# Altium schematic sheet Power.SchDoc
size A4; SheetNumber: 2; SheetTotal: 2
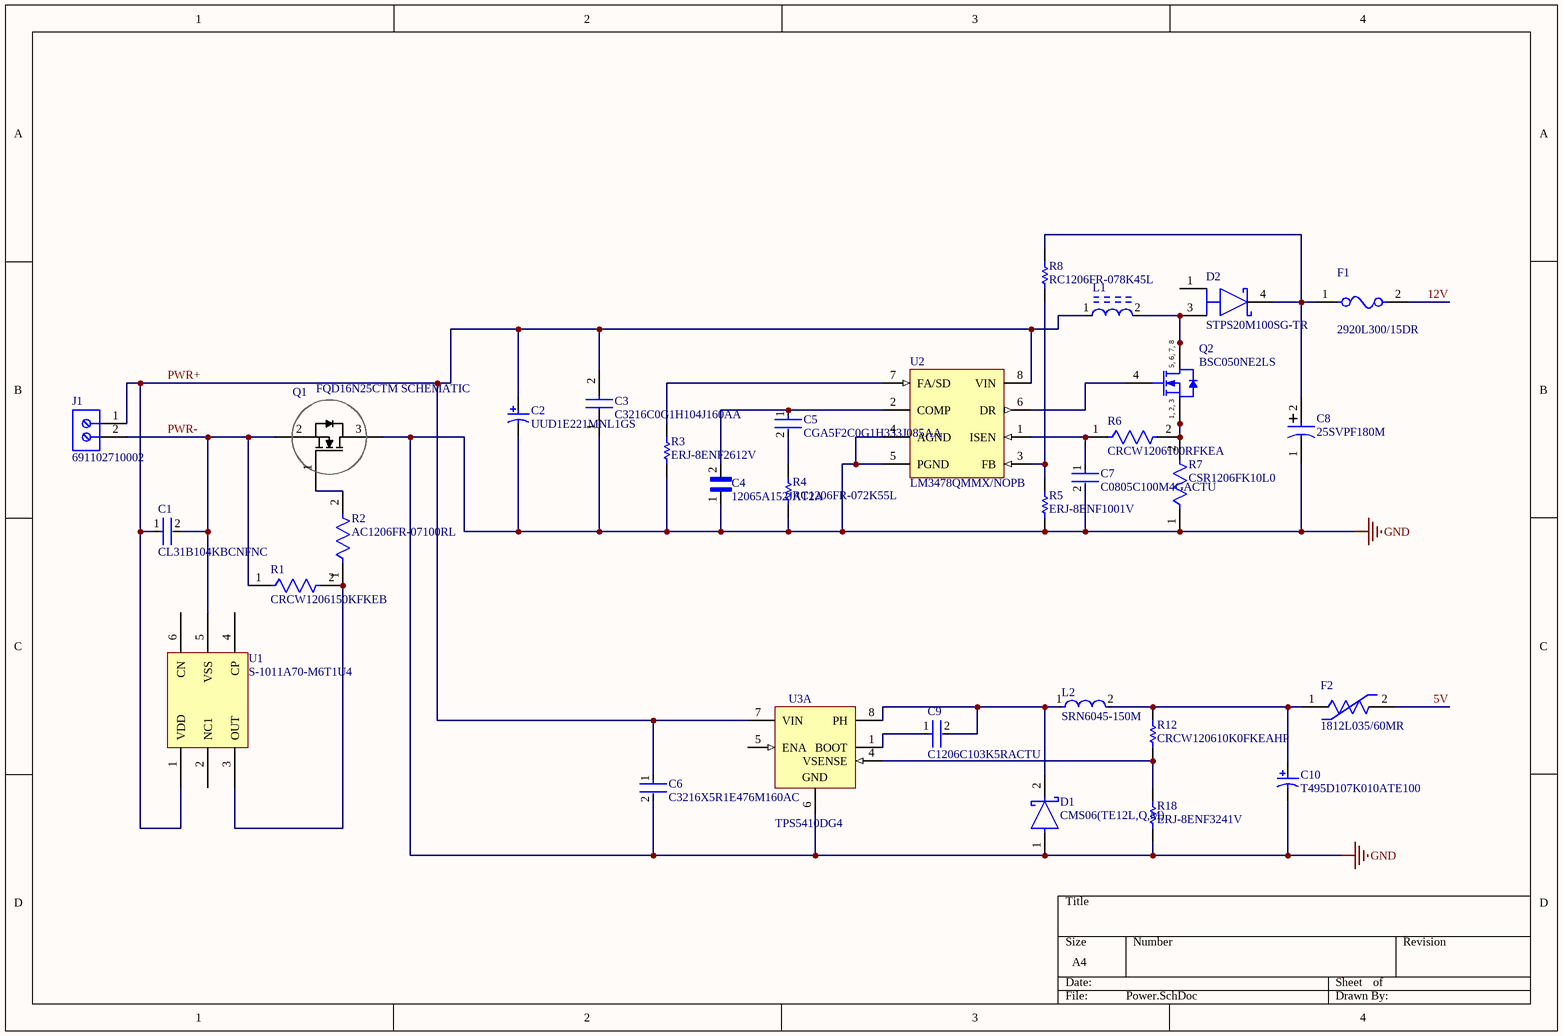
[diagram p0: Power.SchDoc]

## Parts
C1  CL31B104KBCNFNC  [FP-CL31-IPC_C]
C2  UUD1E221MNL1GS  [NIC-CAPA2-8X10_V]
C3  C3216C0G1H104J160AA  [C3216_Commercial]
C4  12065A152JAT2A  [CAPC3216X94N]
C5  CGA5F2C0G1H333J085AA  [FP-CGA5L-0_3-0_1-IPC_C]
C6  C3216X5R1E476M160AC  [FP-C3216-160-MFG]
C7  C0805C100M4GACTU  [FP-C0805C-DN-MFG]
C8  25SVPF180M  [FCV(8X10.2)]
C9  C1206C103K5RACTU  [FP-C1206C-EB-MFG]
C10  T495D107K010ATE100  [KEMT-T495-D_L]
D1  CMS06(TE12L,Q,M)  [FP-M-FLAT-MFG]
D2  STPS20M100SG-TR  [FP-STPS20M100SG-TR-MFG]
F1  2920L300/15DR  [FP-2920L-MFG]
F2  1812L035/60MR  [FP-1812L035-60MR-MFG]
J1  691102710002  [691102710002]
L1  SRP1250-4R7M  [FP-SRP1250-MFG]  (value not drawn)
L2  SRN6045-150M  [FP-SRN6045-MFG]
Q1  FQD16N25CTM SCHEMATIC  [FQD16N25CTM]
Q2  BSC050NE2LS  [INF-PG-TDSON-8-1_V]
R1  CRCW1206150KFKEB  [FP-CRCW1206-e3-IPC_B]
R2  AC1206FR-07100RL  [FP-AC1206-MFG]
R3  ERJ-8ENF2612V  [RESC3216X70X50LL05T20]
R4  RC1206FR-072K55L  [RESC3116X65X40ML10T20]
R5  ERJ-8ENF1001V  [RESC3216X70X50LL05T20]
R6  CRCW1206100RFKEA  [FP-CRCW1206-e3-MFG]
R7  CSR1206FK10L0  [FP-CSR1206-MFG]
R8  RC1206FR-078K45L  [RESC3116X65X40NL10T20]
R12  CRCW120610K0FKEAHP  [RESC3116X65X50NL20T20]
R18  ERJ-8ENF3241V  [RESC3216X70X50LL05T20]
U1  S-1011A70-M6T1U4  [S-1011A70-M6T1U4]
U2  LM3478QMMX/NOPB  [DGK0008A_N]
U3  TPS5410DG4  [D8_L]  (part A of 2)

## Nets
GND: C2.2 C3.1 C4.1 C6.2 C7.2 C8.1(+) C10.2 D1.1(A) Q1.3 R3.1 R4.1 R5.1 R7.1 R18.1 U2.4(AGND) U2.5(PGND) U3.6(GND)
5V: F2.2
12V: F1.2
PWR+: C1.1 C2.1 C3.2 C6.1 J1.1 L1.1 U1.1(VDD) U2.8(VIN) U3.7(VIN)
PWR-: C1.2 J1.2 Q1.2 R1.1 U1.5(VSS)
NetC4_2: C4.2 C5.1 U2.2(COMP)
NetC5_2: C5.2 R4.2
NetC7_1: C7.1 R6.1 U2.1(ISEN)
NetC8_2: C8.2(-) D2.4(K) F1.1 R8.2
NetC9_1: C9.1 U3.1(BOOT)
NetC9_2: C9.2 D1.2(C) L2.1 U3.8(PH)
NetC10_1: C10.1 F2.1 L2.2 R12.2
NetD2_3: D2.3(A) L1.2 Q2.5(DRAIN) Q2.6(DRAIN) Q2.7(DRAIN) Q2.8(DRAIN)
NetQ1_1: Q1.1 R2.2
NetQ2_1: Q2.1(SOURCE) Q2.2(SOURCE) Q2.3(SOURCE) R6.2 R7.2
NetQ2_4: Q2.4(GATE) U2.6(DR)
NetR1_2: R1.2 R2.1 U1.3(OUT)
NetR3_2: R3.2 U2.7(FA/SD)
NetR5_2: R5.2 R8.1 U2.3(FB)
NetR12_1: R12.1 R18.2 U3.4(VSENSE)

Not connected (* = marked no-connect by the designer): D2 1(A); U1 2(NC1) 4(CP) 6(CN); U3 5(ENA)

## Notes on the sheet
- (in symbol CMP-1090-00044-1) 5, 6, 7, 8; 1, 2, 3

## Library data of the parts
C1 = CMP-13271-001276-1: Cap Ceramic 100nF 50V X7R ±10% SMD 1206 +125°C Embossed T/R; Dielectric: X7R; Case Code (Metric): 3216; Package Quantity: 1; Thickness: 0.037inch; Depth: 1.6mm; Packaging: Tape and Reel; Capacitance: 100nF; Length: 0.126inch; Tolerance: 10%; Voltage Rating: 50V; Case Code (Imperial): 1206; Radiation Hardening: No; Width: 0.063inch; Case/Package: 1206; Max Operating Temperature: 125°C; Min Operating Temperature: -55°C; Height: 0.85mm; Mount: Surface Mount
C2 = CMP-0687-00079-1: Aluminum Electrolytic Capacitor, UD Series, Low Impedance, 220 uF, 25 V, + / - 20%, -55 to 105 degC, Chip Type, 8 x 10 mm D x L, Pb-Free, Reel; Manufacturer: Nichicon; Impedance: 0.17 Ohm; Tolerance Rated Capacitance: -20 to 20%; Packing: Dia382mm Reel; Endurance Time: 5000 h; Rated Voltage: 25 V; Rated Ripple Current (at 100kHz): 450 mA; Rated Capacitance: 220 uF; PartNumber: UUD1E221MNL1GS; DatasheetVersion: 08/2012; ComponentLink1Description: Manufacturer URL; Length: 10 mm; ComponentLink3Description: Package Specification; RoHS: TRUE; ComponentLink2Description: Datasheet; Diameter: 8 mm; ComponentLink2URL: http://products.nichicon.co.jp/en/pdf/XJA043/e-ud.pdf; ComponentLink3URL: http://products.nichicon.co.jp/en/pdf/XJA043/e-ud.pdf; PackageReference: CAPAE-D8H10; ComponentLink1URL: http://www.nichicon.co.jp/; PackageDescription: 2-Pin Surface Mount Device, Diameter 8 mm, Height 10 mm, Pitch 6.5 mm; Mounting Technology: Surface Mount
C3 = C3216C0G1H104J160AA: Capacitor; Manufacturer_Name: TDK; Datasheet Link: https://product.tdk.com/system/files/dam/doc/product/capacitor/ceramic/mlcc/catalog/mlcc_commercial_general_en.pdf; Height: 0.75mm; Manufacturer_Part_Number: C3216C0G1H104J160AA
C4 = 12065A152JAT2A: 1500PF 50V 5% 1206; Package: None; Price: None; Value: *; MP: 12065A152JAT2A; Availability: Unavailable
C5 = CMP-08246-000336-1: Cap Ceramic 33nF 50V C0G 5% Pad SMD 1206 +125°C Automotive T/R; Thickness: 0.037inch; Case/Package: 1206; Min Operating Temperature: -55°C; Max Operating Temperature: 125°C; Case Code (Metric): 3216; Voltage Rating: 50V; Width: 0.063inch; Packaging: Tape and Reel; Ratings: AEC-Q200; Height: 0.85mm; Mount: Surface Mount; Weight: 0.000571oz; Tolerance: 5%; Dielectric: C0G; Package Quantity: 1; Depth: 1.6mm; Voltage Rating (DC): 50V; Termination: SMD/SMT; Case Code (Imperial): 1206; Composition: Ceramic; Capacitance: 33nF; Length: 3.2mm
C6 = CMP-2000-05397-2: CAP CER 47UF 25V X5R 1206; 3DS Part Number: 220-00004; Manufacturer: TDK; Temperature Coefficient: 15%; Tolerance: 20%; Material: Ceramic; Height: 1.8mm; Device Class L1: Passive Components; Temperature Characteristic: X5R; Voltage: 25V; Digikey Description: CAP CER 47UF 25V X5R 1206; Voltage Rating: 25V; ComponentLink2URL: https://product.tdk.com/info/en/catalog/datasheets/mlcc_commercial_general_en.pdf; Category: Cap; Capacitance: 47uF; Ipc Land Pattern Name: CAPC320160X160; Temperature Range High: +85°C; ComponentLink2Description: Datasheet; Temperature: -55°C to +85°C; Mouser Description: Multilayer Ceramic Capacitors MLCC - SMD/SMT 1206 47uF 25volts X5R 20%; Lead Free: Yes; RoHS: TRUE; Device Class L2: Capacitors; Device Class L3: Ceramic Capacitors; Manufacturer Part Number: C3216X5R1E476M160AC; Automotive: No; Temperature Range Low: -55°C; Footprint Url: https://product.tdk.com/info/en/catalog/spec/mlccspec_commercial_general_midvoltage_en.pdf; Value: 47uF; Octopart: https://octopart.com/c3216x5r1e476m160ac-tdk-25947783; Package: C3216-160
C7 = CMP-1036-00838-4: CAP CER 10PF 16V 20% NP0 0805; Manufacturer: KEMET; Material: Ceramic; Tolerance: 0.2; Temperature Characteristic: C0G; Temperature Coefficient: 30ppm/°C; Height: 0.88mm; Mouser Description: Multilayer Ceramic Capacitors MLCC - SMD/SMT 16volts 10pF C0G 20%; Device Class L2: Capacitors; Temperature Range Low: -55°C; Manufacturer Part Number: C0805C100M4GACTU; ComponentLink2URL: https://content.kemet.com/datasheets/KEM_C1003_C0G_SMD.pdf; Category: Cap; Octopart: https://octopart.com/c0805c100m4gactu-kemet-16430157; Device Class L1: Passive Components; Capacitance: 10 pF; Temperature: -55°C to +125°C; RoHS: TRUE; Package: C0805C-DN; Device Class L3: Ceramic Capacitors; Automotive: No; Value: 10 pF; Voltage Rating: 16 V; Digikey Description: CAP CER 10PF 16V 20% NP0 0805; Temperature Range High: +125°C; Ipc Land Pattern Name: CAPC200125X78; Lead Free: Yes; ComponentLink2Description: Datasheet
C8 = 25SVPF180M: Capacitor; Manufacturer_Name: Panasonic; Datasheet Link: https://componentsearchengine.com//25SVPF180M.pdf; Mouser2 Part Number: 667-25SVPF180M; Mouser2 Price/Stock: https://www.mouser.com/Search/Refine.aspx?Keyword=667-25SVPF180M; Manufacturer_Part_Number: 25SVPF180M
C9 = CMP-2000-06008-2: CAP CER 10000PF 50V X7R 1206; Manufacturer: KEMET; Material: Ceramic; Temperature Coefficient: 15%; Capacitance: 10,000 pF; Automotive Grade: Grade 0; Value: 10,000 pF; Tolerance: 0.1; Height: 0.88mm; Digikey Description: CAP CER 10000PF 50V X7R 1206; Temperature Range Low: -55°C; Temperature: -55°C to +150°C; Temperature Range High: +150°C; Automotive: Yes; RoHS: TRUE; Lead Free: Yes; Device Class L3: Ceramic Capacitors; Device Class L2: Capacitors; Device Class L1: Passive Components; Octopart: https://octopart.com/c1206c103k5ractu-kemet-130245; Category: Cap; ComponentLink2Description: Datasheet; Mouser Description: Multilayer Ceramic Capacitors MLCC - SMD/SMT 50volts 10000pF X7R 10%; ComponentLink2URL: https://content.kemet.com/datasheets/KEM_C1007_X8R_ULTRA_150C_SMD.pdf; Voltage Rating: 50 V; Package: C1206C-EB; Manufacturer Part Number: C1206C103K5RACTU; Temperature Characteristic: X7R; Ipc Land Pattern Name: CAPC320160X78
C10 = CMP-2000-07206-1: Capacitor, Tantalum, 100 uF, +/- 10%, 10 V, -55 to 125 degC, 2-Pin SMD, RoHS, Tape and Reel; Manufacturer: Kemet; Brand/Series: T495Series; Manufacturer URL: http://www.kemet.com/; Package Description: 2-Pin Surface Mount Device, Body 7.3 x 4.3 mm; Mounting Technology: SurfaceMount; Package Reference: T495-D; Packaging: Tape&amp;Reel; Termination: SMD; Mounting Type: PCB; Material, Element: Tantalum; Datasheet Version: 09/2016; Datasheet URL: http://capacitoredge.kemet.com/capedge2/DataSheet/Datasheet-T495D107K010ATE100.pdf?pn=T495D107K010ATE100
D1 = CMP-2000-06115-2: DIODE SCHOTTKY 30V 2A MFLAT; Forward Voltage: 370mV; Peak Non-Repetitive Surge Current: 40A; Max Reverse Leakage Current: 3mA; Element Configuration: Single; Package Quantity: 1; Max Operating Temperature: 125°C; Mount: Surface Mount; Max Repetitive Reverse Voltage (Vrrm): 30V; Forward Current: 2A; Number of Pins: 2; Min Operating Temperature: -40°C; Radiation Hardening: No; Average Rectified Current: 2A; Contact Plating: Tin; Max Reverse Voltage (DC): 30V; Peak Reverse Current: 3mA; Max Surge Current: 40A; Packaging: Tape and Reel
D2 = CMP-12187-000010-1: DIODE SCHOTTKY 100V 20A D2PAK; Manufacturer: STMicroelectronics; Peak Reverse Current: 10uA; Max Junction Temp: +150°C; Standoff Height: 0mm; Max Surge Forward Current: 350A; Forward Current: 20A; Temperature: to +150°C; Device Class L3: Schottky Diodes; Temperature Range High: +150°C; Device Class L1: Discrete Semiconductors; Mouser Description: Schottky Diodes & Rectifiers 20A 100V; Category: Diode; Max Repetitive Reverse Voltage: 100V; ComponentLink2Description: Datasheet; RoHS: TRUE; ComponentLink2URL: https://www.st.com/resource/en/datasheet/stps20m100s.pdf; Octopart: https://octopart.com/stps20m100sg-tr-stmicroelectronics-17669033; Lead Free: Yes; Package: STPS20M100SG-TR; Height: 4.85mm; Device Class L2: Diodes; Automotive: No; Digikey Description: DIODE SCHOTTKY 100V 20A D2PAK; Manufacturer Part Number: STPS20M100SG-TR
F1 = CMP-2000-05550-2: PTC RESET FUSE 15V 3A 2920; Manufacturer: Littelfuse; Current Rating: 40A; Trip Current: 5A; Trip Time: 20s; Resistance: 0.015-0.048Ω; Value: 0.015-0.048Ω; Device Class L3: unset; Temperature: -40°C to +85°C; ComponentLink2Description: Datasheet; Temperature Range High: +85°C; Digikey Description: PTC RESET FUSE 15V 3A 2920; Lead Free: Yes; Height: 1.25mm; Voltage Rating: 15V; Package: 2920L; Temperature Range Low: -40°C; Ambient Temperature Range High: +85°C; RoHS: TRUE; Ambient Temperature Range Low: -40°C; Device Class L2: PTC Resettable Fuses; Category: Fuse; Automotive: No; ComponentLink2URL: https://m.littelfuse.com/~/media/electronics/datasheets/resettable_ptcs/littelfuse_ptc_2920l_datasheet.pdf.pdf; Device Class L1: Circuit Protection; Hold Current: 3A; Manufacturer Part Number: 2920L300/15DR; Octopart: https://octopart.com/2920l300%2F15dr-littelfuse-673797
F2 = CMP-08606-000011-1: PTC RESET FUSE 60V 350MA 1812; Manufacturer: Littelfuse; Hold Current: 0.35A; Trip Time: 0.15s; Current Rating: 10A; Value: 0.4-1.7Ω; Trip Current: 0.7A; Lead Free: Yes; Voltage Rating: 60V; ComponentLink2URL: https://www.littelfuse.com/~/media/electronics/datasheets/resettable_ptcs/littelfuse_ptc_1812l_datasheet.pdf.pdf; Octopart: https://octopart.com/1812l035%2F60mr-littelfuse-75250819; Automotive: No; Temperature Range Low: -40°C; RoHS: TRUE; Ambient Temperature Range High: +85°C; ComponentLink2Description: Datasheet; Manufacturer Part Number: 1812L035/60MR; Device Class L3: unset; Device Class L2: PTC Resettable Fuses; Ambient Temperature Range Low: -40°C; Temperature: -40°C to +85°C; Package: 0; Temperature Range High: +85°C; Height: 1.8mm; Category: Fuse; Digikey Description: PTC RESET FUSE 60V 350MA 1812; Device Class L1: Circuit Protection; Resistance: 0.4-1.7Ω
J1 = CMP-1502-03258-1: Series 102 - 5.00 mm Horizontal Entry Modular with Pressure Clamp WR-TBL, 2 pin; Manufacturer: Wurth Elektronik; Pin Number: 2; Pitch: 5.00mm; Manufacturer URL: http://www.we-online.de; Mounting Technology: THT; Publisher: WurthElektronik; Packaging: Box; Package Reference: 691102710002; Datasheet URL: http://katalog.we-online.de/em/datasheet/6911027100xx.pdf; Operating Temperature: -40to105degC; Part Number: 691102710002
L1 = CMP-07248-000044-1: FIXED IND 4.7UH 12A 15 MOHM SMD; Material: Ferrite; Tolerance: 20%; Shielding: Shielded; Saturation Current: 27A; Test Frequency: 100kHz; DC Resistance (DCR): 15mR; Radiation Hardening: No; DC Current: 12A; Composition: Wirewound; Military Standard: Not; Inductance: 4.7uH; Case/Package: Nonstandard; Max Operating Temperature: 150°C; Number of Pins: 2; Inductance Tolerance: 20%; Core Material: Ferrite; Current Rating: 12A; Min Operating Temperature: -55°C; RMS Current (Irms): 12A; Termination: SMD/SMT; Mount: Surface Mount; Max DC Current: 12A; Height - Seated (Max): 0.205inch; Package Quantity: 500; Depth: 13.5mm; Width: 13.5mm; Length: 13.9mm; Packaging: Tape and Reel; Height: 5.2mm; REACH SVHC: No SVHC
L2 = CMP-07248-000050-1: FIXED IND 15UH 1.9A 95.8MOHM SMD; Inductance Tolerance: 20%; Self Resonant Frequency: 13MHz; Saturation Current: 2.3A; Core Material: Ferrite; Shielding: Shielded; DC Resistance (DCR): 95.8mR; Test Frequency: 100kHz; Termination: SMD/SMT; Depth: 6.2mm; Max DC Current: 1.9A; Height: 4.5mm; Max Operating Temperature: 125°C; Package Quantity: 1000; Resistor Type: Wirewound; Min Operating Temperature: -40°C; Width: 6mm; Inductance: 15uH; Weight: 0.027725oz; Mount: Surface Mount; Length: 6mm; Series: SRN6045; Packaging: Tape and Reel; DC Current: 1.9A; Number of Pins: 2; Military Standard: Not; REACH SVHC: No SVHC; Tolerance: 20%; Height - Seated (Max): 0.177inch; Current Rating: 1.9A; Case/Package: Nonstandard; RMS Current (Irms): 1.9A
Q2 = CMP-1090-00044-1: N-Channel OptiMOS Power-MOSFET, 25 V VDS, 58 A ID, -55 to 150 degC, PG-TDSON-8-1, Reel, Green; Manufacturer: Infineon; RthJA (max): 50Â K/W; Polarity: N; RthJC (max): 4.5Â K/W; RDS (on) (max): 5Â mOhm; Ptot (max): 28Â W; RDS (on) (max) (@4.5V): 7.1Â mOhm; ID (max): 58Â A; VGS(th) (min): 1.2Â V; VDS (max): 25Â V; QG: 5Â nC; Green: TRUE; IDpuls (max): 232Â A; VGS(th) (max): 2Â V; ComponentLink3Description: Package Specification; ComponentLink2URL: http://www.infineon.com/dgdl/BSC050NE2LS_Rev+2.1_.pdf?folderId=db3a304326dfb1300126fb3bec803f1a&fileId=db3a304326dfb1300126fb5ce0cb3f2d; ComponentLink1Description: Manufacturer URL; Rth: 4.5Â K/W; ComponentLink3URL: http://www.infineon.com/cms/packages/SMD_-_Surface_Mounted_Devices/P-PG-TDSON/P-PG-TDSON-08-01x_2x_3.html?__locale=en; PackageReference: PG-TDSON-8-1; PartNumber: BSC050NE2LS; PackageDescription: 8-Pin Plastic (Green) Thin Dual Small Outline Non-Leaded Package, 5.15 x 5.9 mm Body, 1.27 mm Pitch; DatasheetVersion: Rev. 2.1; Packing: Reel; Mounting Technology: Surface Mount; ComponentLink1URL: http://www.infineon.com/; ComponentLink2Description: Datasheet; Halogen-free: TRUE
R1 = CMP-02407-004217-1: RES Thick Film, 150kΩ, 1%, 0.25W, 100ppm/°C, 1206; Voltage Rating: 200V; Resistance: 150kR; Max Power Dissipation: 250mW; Composition: Thick Film; Tolerance: 1%; Case Code (Imperial): 1206; Temperature Coefficient: 100ppm/°C; Min Operating Temperature: -55°C; Package Quantity: 10000; Military Standard: Not; Length: 3.2mm; Width: 0.063inch; Case Code (Metric): 3216; Features: Automotive AEC-Q200; Lead Free: Lead Free; Height: 0.024inch; Packaging: Tape and Reel; Weight: 0.000353oz; Depth: 1.6mm; Number of Terminations: 2; Case/Package: 1206; Max Operating Temperature: 155°C; Power Rating: 250mW
R2 = CMP-03412-017343-1: RES SMD 100 OHM 1% 1/4W 1206; Manufacturer: Yageo; Voltage Rating: 200V; Automotive Grade: Grade 0; Resistance: 100Ω; Value: 100Ω; Tolerance: 0.01; Power Rating: 0.25W; Octopart: https://octopart.com/ac1206fr-07100rl-yageo-30511025; Device Class L2: Resistors; RoHS: TRUE; Composition: Thick Film; Device Class L3: Chip SMD Resistors; Temperature: -55°C to +155°C; Temperature Range High: +155°C; ComponentLink2URL: http://www.yageo.com/NewPortal/yageodocoutput?fileName=/pdf/R-Chip/PYu-AC_51_RoHS_L_6.pdf; Manufacturer Part Number: AC1206FR-07100RL; Digikey Description: RES SMD 100 OHM 1% 1/4W 1206; Temperature Range Low: -55°C; ComponentLink2Description: Datasheet; Automotive: Yes; Height: 0.65mm; Mouser Description: Thick Film Resistors - SMD 1/4W 100ohm 1% AEC-Q200; Series: AC; Footprint Url: http://www.yageo.com/exep/pages/download/literatures/PYu-R_Mount_10.pdf; Category: Res; Package: AC1206; Device Class L1: Passive Components; Lead Free: Yes; Ipc Land Pattern Name: RESC310160X55
R3 = CMP-2003-00257-1: Manufacturer: Panasonic; Part Number: ERJ-8ENF2612V
R4 = CMP-2003-03669-1: Manufacturer: Yageo; Part Number: RC1206FR-072K55L
R5 = CMP-2003-00017-1: Manufacturer: Panasonic; Part Number: ERJ-8ENF1001V
R6 = CMP-2003-04801-2: RES Thick Film, 100Ω, 1%, 0.25W, 100ppm/°C, 1206; Voltage Rating (DC): 200V; Resistance: 100R; Power Rating: 250mW; Case Code (Metric): 3216; Radiation Hardening: No; Height: 0.55mm; Packaging: Tape and Reel; Depth: 1.6mm; Weight: 0.000353oz; Termination: SMD/SMT; Lead Free: Lead Free; Min Operating Temperature: -55°C; Contact Plating: Tin; Max Operating Temperature: 155°C; Case Code (Imperial): 1206; Military Standard: Not; Width: 1.6mm; Number of Pins: 2; Voltage Rating: 200V; Composition: Thick Film; Package Quantity: 5000; Tolerance: 1%; Case/Package: 1206; Mount: Surface Mount; Length: 3.2mm; Temperature Coefficient: 100ppm/°C
R7 = CMP-26527-000118-1: RES 0.01 OHM 1% 1/2W 1206; Max Power Dissipation: 500mW; Temperature Coefficient: 100ppm/°C; Resistance: 10mR; RoHS Compliant: Yes; Construction: Rectangular; Resistor Type: Thick Film; Military Standard: Not; Lead Free: Lead Free; Size Code: 1206; Case/Package: 1206; Case Code (Metric): 3216; Radiation Hardening: No; Contact Plating: Tin; Series: CSR; Max Operating Temperature: 155°C; Power Rating: 500mW; Mount: Surface Mount; Number of Terminations: 2; Packaging: Tape and Reel; Length: 0.12inch; Min Operating Temperature: -55°C; Width: 0.061inch; Depth: 1.55mm; Case Code (Imperial): 1206; Height: 0.026inch; Tolerance: 1%
R8 = CMP-2003-03894-1: Manufacturer: Yageo; Part Number: RC1206FR-078K45L
R12 = CMP-2003-04883-1: Manufacturer: Vishay Dale; Part Number: CRCW120610K0FKEAHP
R18 = CMP-2003-00303-1: Manufacturer: Panasonic; Part Number: ERJ-8ENF3241V
U2 = CMP-0063-01299-4: High Efficiency Low-Side N-Channel Controller for Switching Regulator, Automotive Grade 1, 8-pin MSOP, Pb-Free, 3500 Reel; Manufacturer: Texas Instruments; CompType: MiscPower; High-Reliability: Y; PowerWise: N; PackageTopMarking: ZXTT*SSFB; PackageReference: DGK0008A; ComponentLink1Description: Datasheet URL; PackageDescription: MINI SOIC, .118 x .118 x .034in, 8 Lead, .0256in Pitch; ComponentLink1URL: http://www.ti.com/general/docs/lit/getliterature.tsp?genericPartNumber=LM3478Q-Q1&fileType=pdf; PartNumber: LM3478QMMX/NOPB; RoHS: Y; Code_JEDEC: MO-187-AA; PinCount: 8
U3 = CMP-0323-00190-2: Buck Step Down Regulator with 5.5 to 36 V Input and 1.23 to 31 V Output, -40 to 125 degC, 8-Pin SOIC (D), Green (RoHS & no Sb/Br); Manufacturer: Texas Instruments; Duty Cycle(Max)(%): 87.5; SubFamily: Step-Down Regulator; Switch Current Limit(Typ)(A): 1.2; Rating: Catalog; Vin(Max)(V): 36; Vin(Min)(V): 5.5; Vout(Max)(V): 31; Iout(Max)(A): 1; Iq(Typ)(mA): 3; Vout(Min)(V): 1.23; ComponentLink1URL: http://www.ti.com/general/docs/lit/getliterature.tsp?genericPartNumber=TPS5410&fileType=pdf; ComponentLink3URL: Samples URL:http://www.ti.com/product/tps5410#samples; Mounting Technology: Surface Mount; DatasheetVersion: SLVS675A; Code_JEDEC: MS-012AA; Topology: Buck; ComponentLink3Description: URL Link1; PackageDescription: 8-Pin Plastic Small Outline Integrated Circuit, 4.9 x 3.9 mm, Pitch 1.27 mm Pitch; ComponentLink2Description: Package Specification; PartNumber: TPS5410DG4; PackageVersion: revM, Jun-2011; ComponentLink2URL: http://www.ti.com/litv/pdf/msoi002j; ComponentLink1Description: Datasheet; Eco-Plan: Green (RoHS & no Sb/Br); PackageReference: D8; Regulated Outputs(#): 1